# EAGLE design studna (EAGLE 7.7.0)
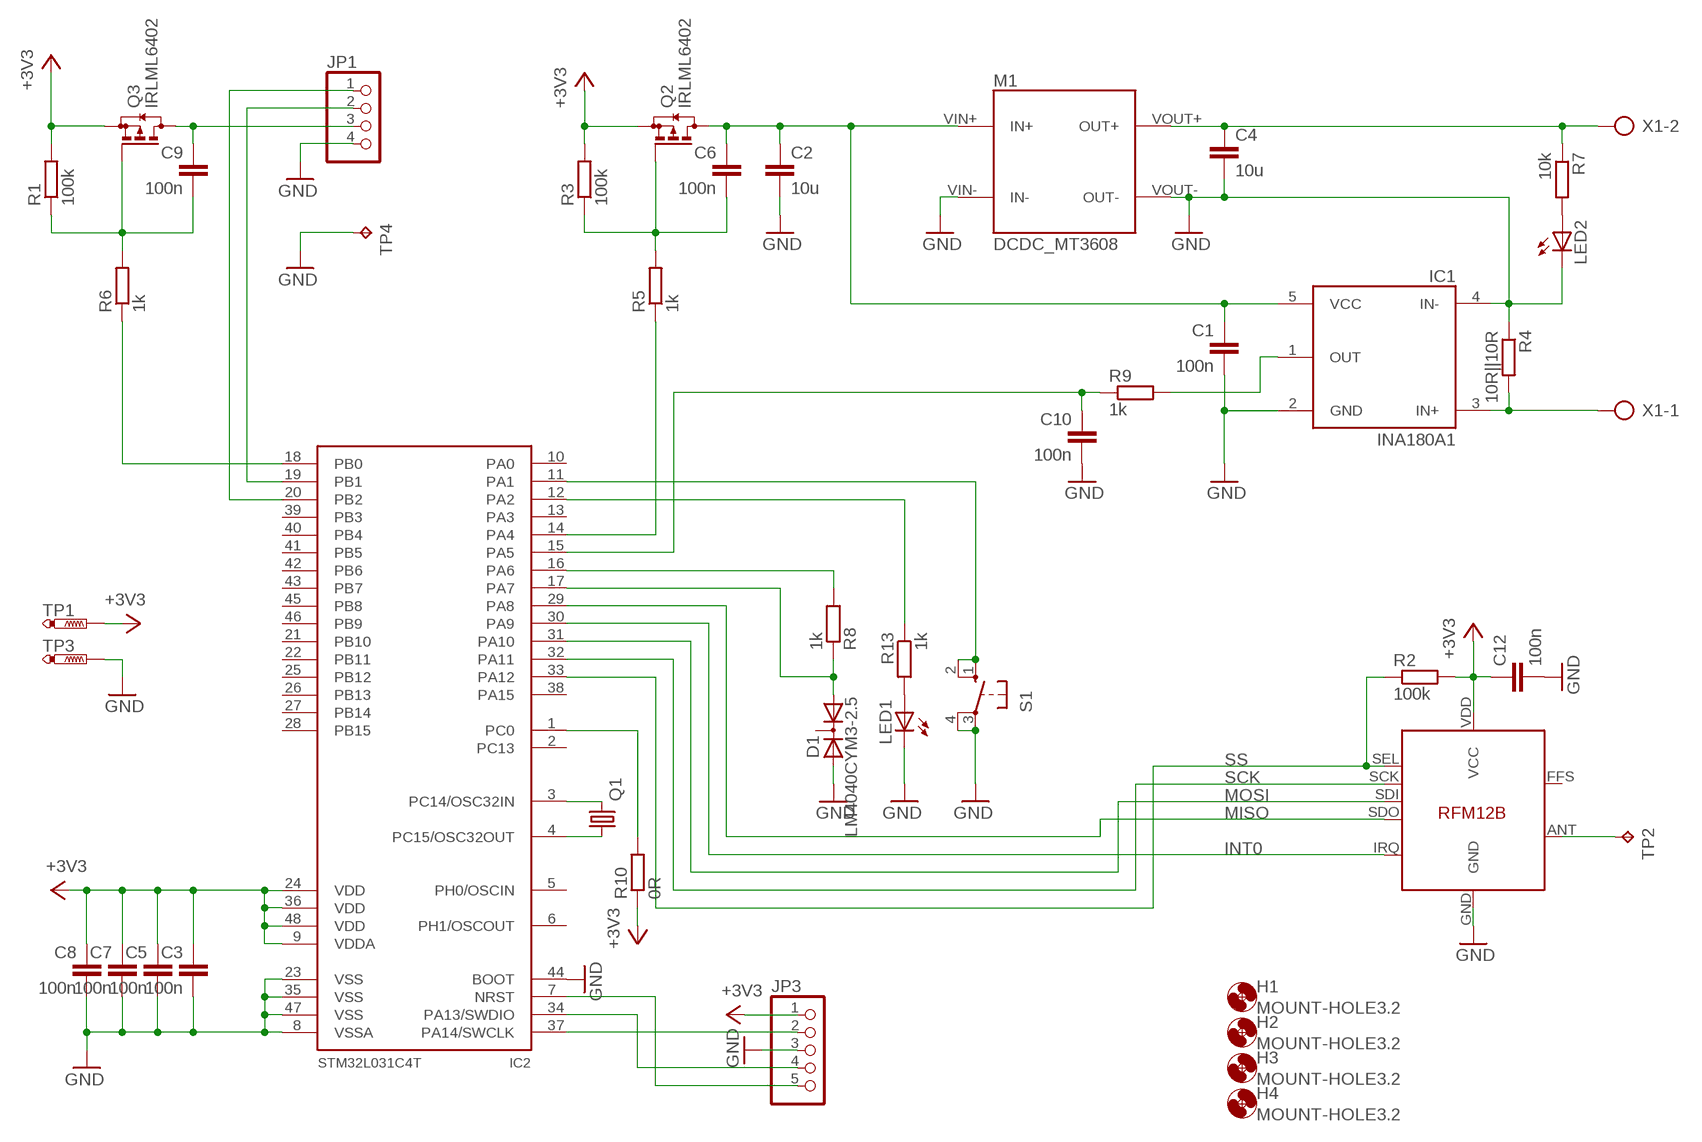
[diagram p0: schematic, sheet 1]

## Parts
C1  100n  C-EUC0603  [C0603]
C2  10u  C-EUC1206K  [C1206K]
C3  100n  C-EUC0603  [C0603]
C4  10u  C-EUC1206K  [C1206K]
C5  100n  C-EUC0603  [C0603]
C6  100n  C-EUC0603  [C0603]
C7  100n  C-EUC0603  [C0603]
C8  100n  C-EUC0603  [C0603]
C9  100n  C-EUC0603  [C0603]
C10  100n  C-EUC0603  [C0603]
C12  100n  C-EUC0603  [C0603]
D1  LM4040CYM3-2.5  DIODE-2AC|CASOT23  [SOT23]
H1  MOUNT-HOLE3.2  [3,2]
H2  MOUNT-HOLE3.2  [3,2]
H3  MOUNT-HOLE3.2  [3,2]
H4  MOUNT-HOLE3.2  [3,2]
IC1  INA180A1  INA180  [SOT23-5L]
IC2  STM32L031C4T  [LQFP48]
IC3  RFM12B  [RFM12B]
JP1  PINHD-1X4  [1X04]
JP3  PINHD-1X5  [1X05]
LED1  LED3MM  [LED3MM]
LED2  LED3MM  [LED3MM]
M1  DCDC_MT3608  [DCDC_MT3608]
Q1  CRYSTALTC38H  [TC38H]
Q2  IRLML6402  BSS84  [SOT23]
Q3  IRLML6402  BSS84  [SOT23]
R1  100k  R-EU_R0603  [R0603]
R2  100k  R-EU_R0603  [R0603]
R3  100k  R-EU_R0603  [R0603]
R4  10R||10R  R-EU_R1206  [R1206]
R5  1k  R-EU_R0603  [R0603]
R6  1k  R-EU_R0603  [R0603]
R7  10k  R-EU_R0603  [R0603]
R8  1k  R-EU_R0603  [R0603]
R9  1k  R-EU_R0603  [R0603]
R10  0R  R-EU_R0603  [R0603]
R13  1k  R-EU_R0603  [R0603]
S1  10-XX  [B3F-10XX]
TP1  PTR1PAD1-17Y  [P1-17Y]
TP2  TPB2,54  [B2,54]
TP3  PTR1PAD1-17Y  [P1-17Y]
TP4  TPPAD1-13Y  [P1-13Y]
X1  AK500/2  [AK500/2]

## Nets
+3V3 [power]: C3.1 C5.1 C7.1 C8.1 C12.1 IC2.9(VDDA) IC2.24(VDD) IC2.36(VDD) IC2.48(VDD) IC3.VDD(VCC) JP3.1 Q2.2(S) Q3.2(S) R1.2 R2.2 R3.2 R10.1 TP1.TP
DCDC_3V3: C1.1 C2.1 C6.1 IC1.5(VCC) M1.VIN+(IN+) Q2.3(D)
DISP_3V3: C9.1 JP1.3 Q3.3(D)
GND: C1.2 C2.2 C3.2 C4.2 C5.2 C7.2 C8.2 C10.2 C12.2 D1.2(A2) IC1.2(GND) IC1.4(IN-) IC2.8(VSSA) IC2.23(VSS) IC2.35(VSS) IC2.44(BOOT) IC2.47(VSS) IC3.GND JP1.4 JP3.3 LED1.K(C) LED2.K(C) M1.VIN-(IN-) M1.VOUT-(OUT-) R4.1 S1.3(P) S1.4(P1) TP3.TP TP4.TP
INT0: IC2.30(PA9) IC3.IRQ
MISO: IC2.29(PA8) IC3.SDO
MOSI: IC2.31(PA10) IC3.SDI
N$1: C6.2 Q2.1(G) R3.1 R5.2
N$2: D1.1(A1) IC2.17(PA7) R8.1
N$3: IC1.3(IN+) R4.2 X1.1
N$4: IC2.4(PC15/OSC32OUT) Q1.1
N$5: IC2.3(PC14/OSC32IN) Q1.2
N$6: IC3.ANT TP2.TP
N$7: C4.1 M1.VOUT+(OUT+) R7.1 X1.2
N$8: C10.1 IC2.15(PA5) R9.1
N$9: LED2.A R7.2
N$10: IC2.19(PB1) JP1.2
N$11: IC2.14(PA4) R5.1
N$12: IC1.1(OUT) R9.2
N$13: IC2.16(PA6) R8.2
N$14: LED1.A R13.2
N$15: IC2.11(PA1) S1.1(S) S1.2(S1)
N$16: IC2.1(PC0) R10.2
N$17: C9.2 Q3.1(G) R1.1 R6.2
N$18: IC2.18(PB0) R6.1
N$19: IC2.20(PB2) JP1.1
N$29: IC2.12(PA2) R13.1
N$137: IC2.34(PA13/SWDIO) JP3.4
N$138: IC2.37(PA14/SWCLK) JP3.2
N$143: IC2.7(NRST) JP3.5
SCK: IC2.32(PA11) IC3.SCK
SS: IC2.33(PA12) IC3.SEL R2.1
Unconnected: D1.3(C) IC2.2(PC13) IC2.5(PH0/OSCIN) IC2.6(PH1/OSCOUT) IC2.10(PA0) IC2.13(PA3) IC2.21(PB10) IC2.22(PB11) IC2.25(PB12) IC2.26(PB13) IC2.27(PB14) IC2.28(PB15) IC2.38(PA15) IC2.39(PB3) IC2.40(PB4) IC2.41(PB5) IC2.42(PB6) IC2.43(PB7) IC2.45(PB8) IC2.46(PB9) IC3.FFS

## Library data of the parts
C1-C10 C12 = rcl:C-EU: CAPACITOR, European symbol
D1 = diode:DIODE-2AC|CA: Dual DIODE Anode-Cathode|Cathode-Anode
H1-H4 = holes:MOUNT-HOLE: MOUNTING HOLE with drill center marker
IC1 = alpov:INA180
IC2 = alpov2:STM32L031C4T
IC3 = JeeLabs:RFM12B
JP1 = pinhead:PINHD-1X4: PIN HEADER
JP3 = pinhead:PINHD-1X5: PIN HEADER
LED1 LED2 = led:LED: LED OSRAM: - CHIPLED LG R971, LG N971, LY N971, LG Q971, LY Q971, LO R971, LY R971 LH N974, LH R974 LS Q976, LO Q976, LY Q976 LO Q996 - Hyper CHIPLED LW Q18S LB Q993, LB Q99A, LB R99A - SideLED LS A670, LO A670, LY A670, LG A670, LP A670 LB A673, LV A673, LT A673, LW A673 LH A674 LY A675 LS A676, LA A676, LO A676, LY A676, LW A676 LS A679, LY A679, LG A679 - Hyper Micro SIDELED® LS Y876, LA Y876, LO Y876, LY Y876 LT Y87S - SmartLED LW L88C, LW L88S LB L89C, LB L89S, LG L890 LS L89K, LO L89K, LY L89K LS L896, LA L896, LO L896, LY L896 - TOPLED LS T670, LO T670, LY T670, LG T670, LP T670 LSG T670, LSP T670, LSY T670, LOP T670, LYG T670 LG T671, LOG T671, LSG T671 LB T673, LV T673, LT T673, LW T673 LH T674 LS T676, LA T676, LO T676, LY T676, LB T676, LH T676, LSB T676, LW T676 LB T67C, LV T67C, LT T67C, LS T67K, LO T67K, LY T67K, LW E67C LS E67B, LA E67B, LO E67B, LY E67B, LB E67C, LV E67C, LT E67C LW T67C LS T679, LY T679, LG T679 LS T770, LO T770, LY T770, LG T770, LP T770 LB T773, LV T773, LT T773, LW T773 LH T774 LS E675, LA E675, LY E675, LS T675 LS T776, LA T776, LO T776, LY T776, LB T776 LHGB T686 LT T68C, LB T68C - Hyper Mini TOPLED® LB M676 - Mini TOPLED Santana® LG M470 LS M47K, LO M47K, LY M47K Source: http://www.osram.convergy.de LUXEON: - LUMILED® LXK2-PW12-R00, LXK2-PW12-S00, LXK2-PW14-U00, LXK2-PW14-V00 LXK2-PM12-R00, LXK2-PM12-S00, LXK2-PM14-U00 LXK2-PE12-Q00, LXK2-PE12-R00, LXK2-PE12-S00, LXK2-PE14-T00, LXK2-PE14-U00 LXK2-PB12-K00, LXK2-PB12-L00, LXK2-PB12-M00, LXK2-PB14-N00, LXK2-PB14-P00, LXK2-PB14-Q00 LXK2-PR12-L00, LXK2-PR12-M00, LXK2-PR14-Q00, LXK2-PR14-R00 LXK2-PD12-Q00, LXK2-PD12-R00, LXK2-PD12-S00 LXK2-PH12-R00, LXK2-PH12-S00 LXK2-PL12-P00, LXK2-PL12-Q00, LXK2-PL12-R00 Source: www.luxeon.com KINGBRIGHT: KA-3528ASYC Source: www.kingbright.com
M1 = alpov:DCDC
Q1 = crystal:CRYSTAL: CRYSTAL; OC_FARNELL: unknown; OC_NEWARK: unknown
Q2 Q3 = transistor-small-signal:BSS84: P-CHANNEL MOS FET
R1-R10 R13 = rcl:R-EU_: RESISTOR, European symbol
S1 = switch-omron:10-XX: OMRON SWITCH; MPN: B3F-1000; OC_FARNELL: 176432; OC_NEWARK: 36M3542
TP1 TP3 = testpad:PTR1: TEST PIN
TP2 TP4 = testpad:TP: Test pad
X1 = con-ptr500:AK500/2: CONNECTOR; OC_FARNELL: unknown; OC_NEWARK: unknown

## Net classes
1 power: width 0.2 mm

## Board
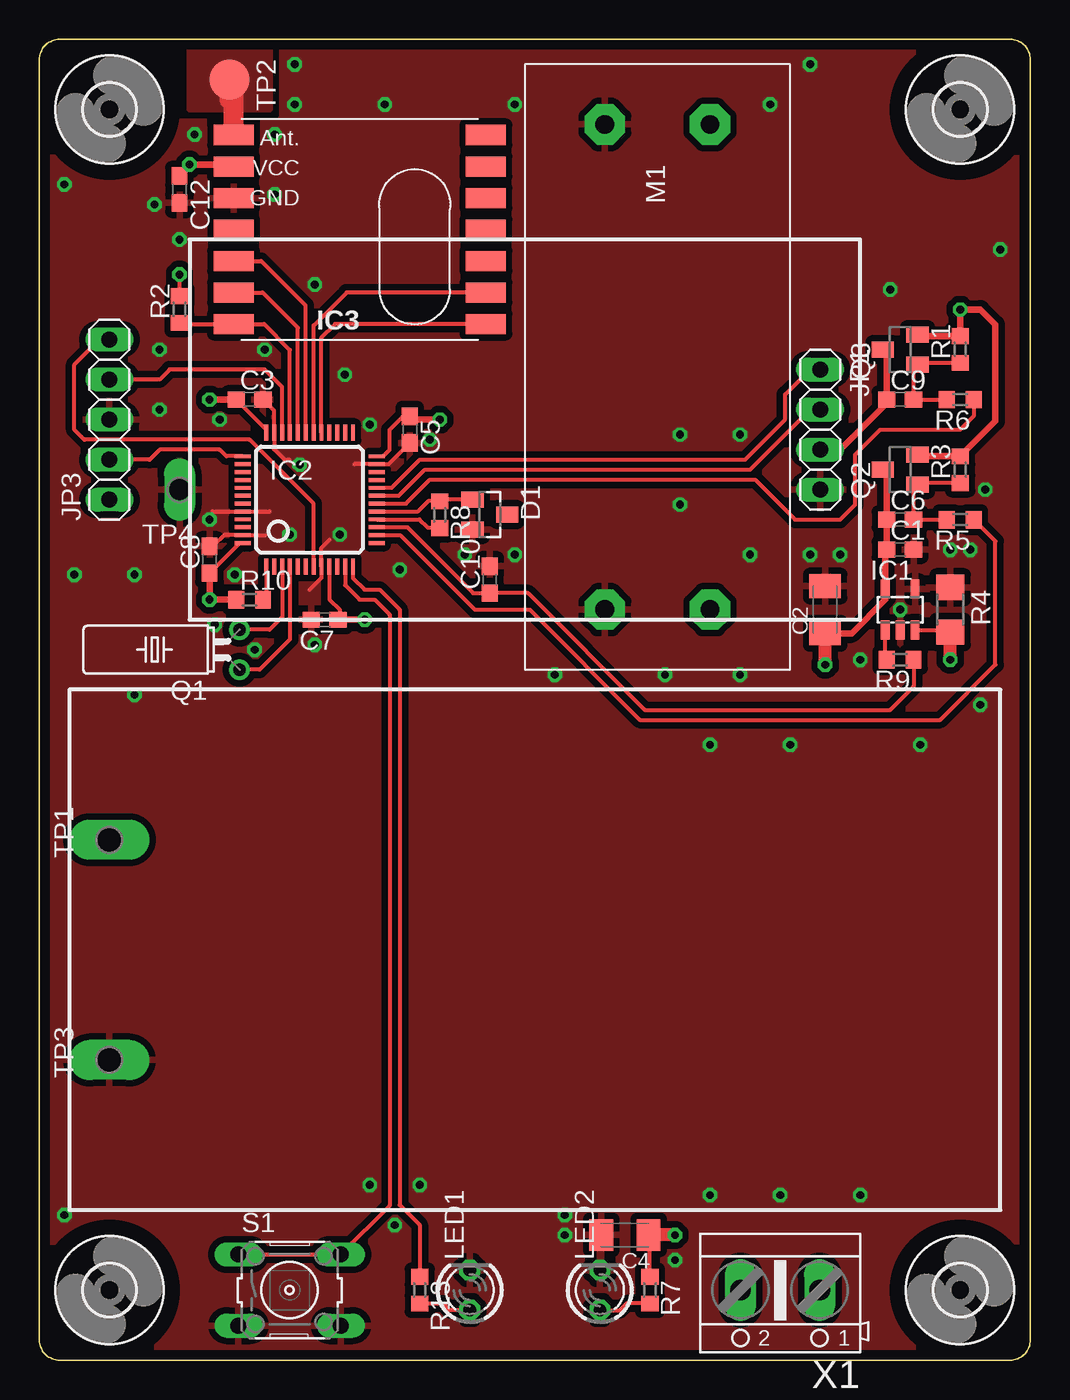
[diagram p1: board, top side]
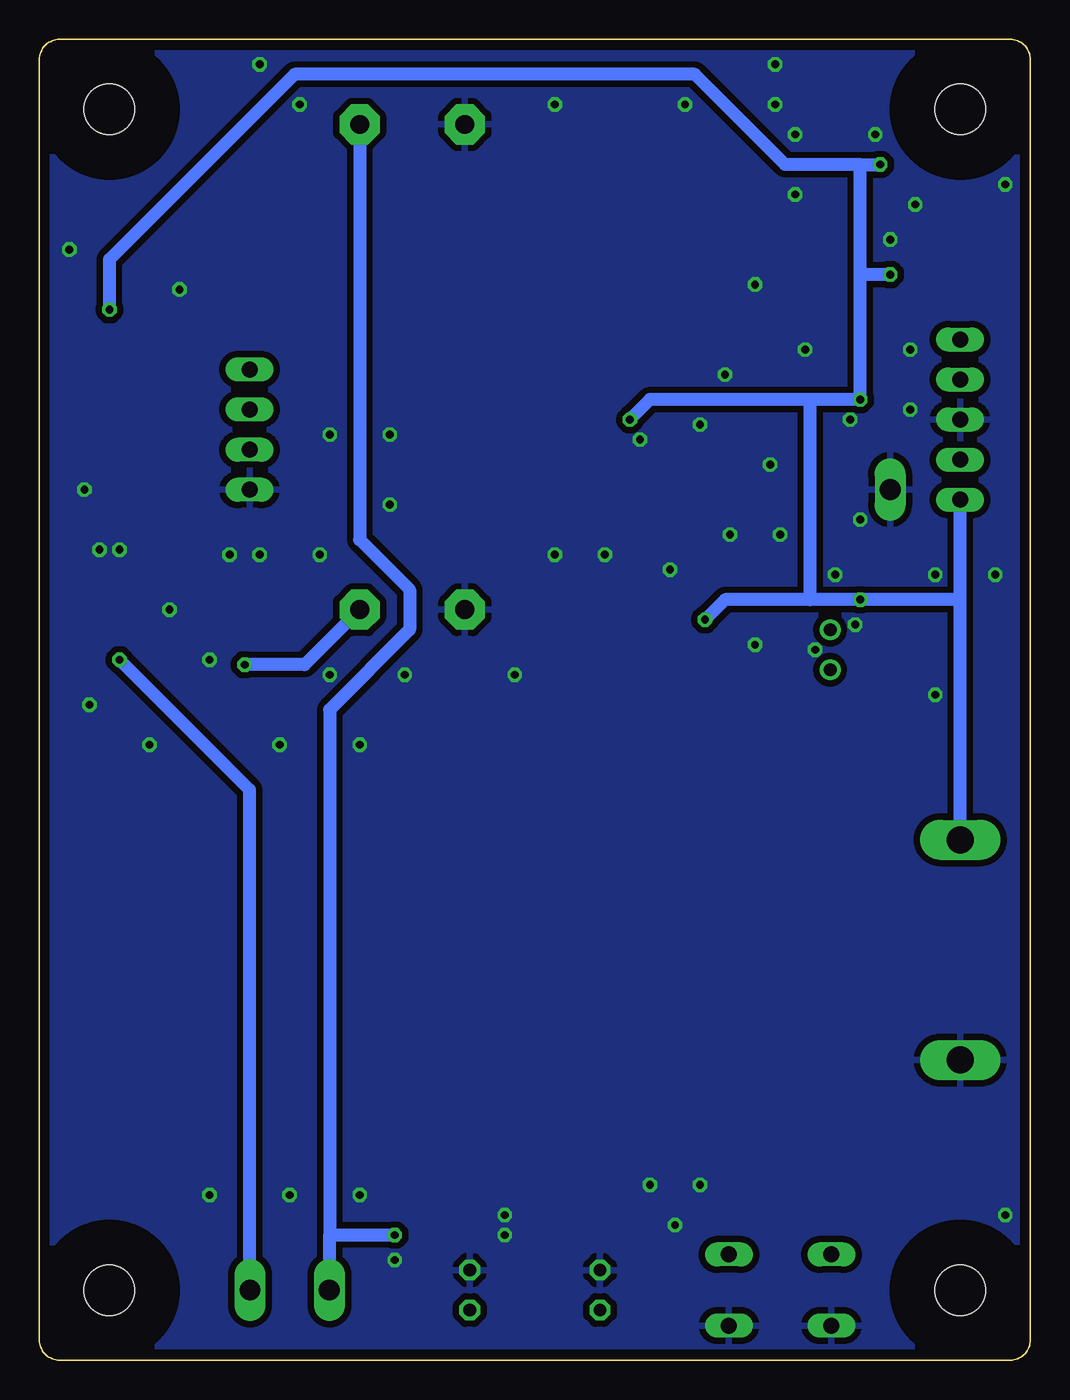
[diagram p2: board, bottom side, seen from below]

Size 62.87 x 83.82 mm. Coordinates in mm from the lower left corner, seen from the top.
Outline: 1.27,0 61.59,0 arc90 62.87,1.27 62.87,82.55 arc90 61.59,83.82 1.27,83.82 arc90 0,82.55 0,1.27 arc90 1.27,0
Copper layers (1*16): Top 0.035mm / dielectric 1.5mm / Bottom 0.035mm
Design rules "default *": minimum track width 0.25mm, minimum drill 0.5mm, track to track 8mil, track to pad 8mil, pad to pad 8mil, via to via 8mil, smd to smd 0mil, copper to edge 24mil, drill to drill 8mil, minimum pad ring 10mil, minimum via ring 8mil, stop-mask expansion 4mil, vias tented up to drill 0.5mm, thermal gap 16mil

### Footprints (pad centres in the part's own frame; a part is rotated, then mirrored left to right if it is on the bottom)
C0603 = smd 1.1 x 1: 1 -0.85,0; 2 0.85,0
C1206K = smd 1.5 x 2: 1 -1.5,0; 2 1.5,0
SOT23 = smd 1 x 1.4: 1 -0.95,-1.1; 2 0.95,-1.1; 3 0,1.1
3,2 = hole 3.2: 0,0
SOT23-5L = smd 0.55 x 1.2: 1 -0.95,-1.3; 2 0,-1.3; 3 0.95,-1.3; 4 0.95,1.3; 5 -0.95,1.3
LQFP48 = smd 0.25 x 1: 1 -2.75,-4.25; 2 -2.25,-4.25; 3 -1.75,-4.25; 4 -1.25,-4.25; 5 -0.75,-4.25; 6 -0.25,-4.25; 7 0.25,-4.25; 8 0.75,-4.25; 9 1.25,-4.25; 10 1.75,-4.25; 11 2.25,-4.25; 12 2.75,-4.25; 25 2.75,4.25; 26 2.25,4.25; 27 1.75,4.25; 28 1.25,4.25; 29 0.75,4.25; 30 0.25,4.25; 31 -0.25,4.25; 32 -0.75,4.25; 33 -1.25,4.25; 34 -1.75,4.25; 35 -2.25,4.25; 36 -2.75,4.25 | smd 1 x 0.25: 13 4.25,-2.75; 14 4.25,-2.25; 15 4.25,-1.75; 16 4.25,-1.25; 17 4.25,-0.75; 18 4.25,-0.25; 19 4.25,0.25; 20 4.25,0.75; 21 4.25,1.25; 22 4.25,1.75; 23 4.25,2.25; 24 4.25,2.75; 37 -4.25,2.75; 38 -4.25,2.25; 39 -4.25,1.75; 40 -4.25,1.25; 41 -4.25,0.75; 42 -4.25,0.25; 43 -4.25,-0.25; 44 -4.25,-0.75; 45 -4.25,-1.25; 46 -4.25,-1.75; 47 -4.25,-2.25; 48 -4.25,-2.75
RFM12B = smd 2.54 x 1.27: ANT 8,-6; FFS -8,2; GND 8,-2; IRQ -8,4; P$8 -8,0; P$9 -8,-2; P$10 -8,-4; P$12 -8,-6; P$16 8,0; SCK 8,4; SDI 8,2; SDO -8,6; SEL 8,6; VDD 8,-4
1X04 = drill 1.016 long: 1 -3.81,0; 2 -1.27,0; 3 1.27,0; 4 3.81,0
1X05 = drill 1.016 long: 1 -5.08,0; 2 -2.54,0; 3 0,0; 4 2.54,0; 5 5.08,0
LED3MM = drill 0.813 octagon: A -1.27,0; K 1.27,0
DCDC_MT3608 = drill 1.2 pad 2.54 octagon: VIN+ 30.797,6.668; VIN- 30.797,0; VOUT+ 0,6.668; VOUT- 0,0
TC38H = drill 0.813: 1 -1.27,0; 2 1.27,0
R0603 = smd 1 x 1.1: 1 -0.85,0; 2 0.85,0
R1206 = smd 1.6 x 1.803: 1 -1.422,0; 2 1.422,0
B3F-10XX = drill 1.016 long: 1 -3.251,2.261; 2 3.251,2.261; 3 -3.251,-2.261; 4 3.251,-2.261
P1-17Y = drill 1.702 pad 2.121 long: TP 0,0
B2,54 = smd 2.54 x 2.54: TP 0,0
P1-13Y = drill 1.321 pad 1.905 long: TP 0,0
AK500/2 = drill 1.321 long: 1 -2.515,0; 2 2.515,0

### Placement (x,y rotation side)
C1  54.61,51.44 0 top
C2  49.85,47.62 90 top
C3  13.34,60.96 0 top
C4  37.15,7.94 180 top
C5  23.5,59.05 270 top
C6  54.61,53.34 0 top
C7  18.1,46.99 180 top
C8  10.79,50.8 90 top
C9  54.61,60.96 0 top
C10  28.57,49.53 90 top
C12  8.89,74.3 270 top
D1  28.57,53.66 270 top
H1  4.45,4.45 0 top
H2  58.42,4.45 0 top
H3  4.45,79.38 0 top
H4  58.42,79.38 0 top
IC1  54.61,47.62 0 top
IC2  17.14,54.61 0 top
IC3  20.32,71.75 180 top
JP1  49.53,59.05 270 top
JP3  4.45,59.69 90 top
LED1  27.3,4.45 90 top
LED2  35.56,4.45 90 top
M1  35.88,78.42 270 top
Q1  12.7,45.09 90 top
Q2  54.61,56.52 90 top
Q3  54.61,64.14 90 top
R1  58.42,64.14 90 top
R2  8.89,66.67 90 top
R3  58.42,56.52 90 top
R4  57.78,47.62 270 top
R5  58.42,53.34 180 top
R6  58.42,60.96 180 top
R7  38.73,4.45 270 top
R8  25.4,53.66 270 top
R9  54.61,44.45 180 top
R10  13.34,48.26 0 top
R13  24.13,4.45 270 top
S1  15.88,4.45 0 top
TP1  4.45,33.02 90 top
TP2  12.06,81.28 270 top
TP3  4.45,19.05 90 top
TP4  8.89,55.24 180 top
X1  46.99,4.45 180 top

### Tracks (layer width: path | path; a pad name or v marks a point on that pad's centre or on a via)
+3V3  (via drill 0.5)
  Top 0.254: IC2.36 14.39,59.05 C3.1 | IC2.48 12.71,51.86 C8.1 | 12.19,75.88 IC3.VDD | v9.53,75.88 9.63,75.88 | IC2.9 18.39,48.28 19.05,47.62 19.05,47.09 C7.1 | 55.81,57.37 Q2.2 | 55.81,64.98 Q3.2 | IC2.24 21.8,57.36 22.23,57.78 22.23,59.05 23.07,59.91 C5.1 | R2.2 v8.89,68.9
  Top 0.406: C8.1 v10.79,48.26 R10.1 | C7.1 v20.64,46.99 | v25.4,59.69 23.71,59.69 C5.1 | v10.79,60.96 C3.1 | v9.53,75.88 12.19,75.88 | 9.63,75.88 C12.1 | 55.81,57.37 R3.2 60.64,59.59 60.64,65.72 59.69,66.67 v58.42,66.67 R1.2 55.81,64.98
  Bottom 0.813: 13.97,48.26 v10.79,48.26 4.45,48.26 | 13.97,48.26 19.37,48.26 v20.64,46.99 | 13.97,48.26 13.97,60.96 | 13.97,60.96 v10.79,60.96 10.79,68.9 | 13.97,60.96 24.13,60.96 v25.4,59.69 | 10.79,75.88 v9.53,75.88 | 10.79,68.9 10.79,75.88 | TP1.TP 4.45,48.26 | 4.45,48.26 JP3.1 | 10.79,75.88 15.56,75.88 21.27,81.6 46.67,81.6 58.42,69.85 v58.42,66.67 | v8.89,68.9 10.79,68.9
DCDC_3V3  (via drill 0.5)
  Top 0.254: 53.66,51.34 C1.1 | 53.76,56.27 Q2.3 | IC1.5
  Top 0.406: IC1.5 53.66,51.34 | 53.76,56.27 C6.1 C1.1 | C2.1 51.52,46.12 53.66,48.26 IC1.5
  Top 0.813: v49.85,44.13 C2.1
  Bottom 0.813: M1.VIN+ 46.04,44.13 v49.85,44.13
DISP_3V3
  Top 0.406: Q3.3 53.76,63.88 C9.1 53.76,60.74 50.8,57.78 JP1.3
GND  (via drill 0.5)
  Top 0.254: C3.2 14.89,60.25 IC2.35 14.89,57.81 15.56,57.15 15.88,57.15 | C5.2 22.15,56.86 IC2.23 19.98,56.86 | 16.94,47.3 C7.2 | 14.31,52.36 IC2.47 11.72,52.36 11.01,51.65 C8.2 | 18.41,52.07 17.89,51.55 IC2.8 17.89,49.65 17.14,48.9 | IC2.44 14.61,53.86 | 10.99,53.86 12.7,53.86
  other vias: 7.62,60.33 8.89,71.12 22.86,50.16 53.98,67.94 57.78,51.44 48.9,51.12 26.99,51.12 14.92,77.79 30.16,79.69 19.37,62.55 6.03,49.85 33.34,7.94 39.69,43.5 52.07,44.45 60.96,70.48 16.19,79.69 16.19,82.23 9.84,77.79 14.92,73.98 21.91,79.69 17.46,68.26 1.59,74.61 14.29,64.14 7.62,64.14 20.95,59.37 16.51,56.83 19.05,52.39 15.88,52.39 12.38,49.85 6.03,42.23 17.46,45.4 32.7,43.5 44.45,43.5 45.09,51.12 40.64,54.29 44.45,58.74 40.64,58.74 24.77,58.42 46.35,79.69 48.9,82.23 60.01,55.24 54.61,47.62 50.8,51.12 59.05,51.44 59.69,41.59 47.62,39.05 55.88,39.05 42.55,39.05 20.95,11.11 24.13,11.11 42.55,10.48 46.99,10.48 52.07,10.48 33.34,9.21 1.59,9.21 11.43,59.69 10.79,53.34 30.16,51.12 7.3,73.34 2.22,49.85 11.11,46.67 13.65,45.09 22.54,8.57 40.32,6.35
  pour Top (isolate 0.406, rank 6): 0,0 62.87,0 62.87,83.82 0,83.82
  pour Bottom (isolate 0.406, rank 6): 0,0 62.87,0 62.87,83.82 0,83.82
INT0
  Top 0.254: IC2.30 17.39,65.66 19.5,67.75 IC3.IRQ
MISO
  Top 0.254: IC2.29 17.89,64.89 18.77,65.75 IC3.SDO
MOSI
  Top 0.254: IC2.31 16.89,66.92 14.06,69.75 IC3.SDI
N$1
  Top 0.254: R5.2 C6.2 55.46,55.31 Q2.1 55.81,55.66 R3.1
N$2
  Top 0.254: IC2.17 24.02,53.86 24.66,54.51 R8.1 25.5,54.61 D1.1
N$3  (via drill 0.5)
  Top 0.254: IC1.3 57.66,46.33 R4.2
  Top 0.813: v57.78,44.45 R4.2
  Bottom 0.406: X1.1 49.53,4.45
  Bottom 0.813: 49.53,4.45 49.53,36.2 v57.78,44.45
N$4
  Top 0.254: IC2.4 15.89,45.74 13.97,43.81 Q1.1
N$5
  Top 0.254: IC2.3 15.39,47.15 14.61,46.35 Q1.2
N$6
  Top 1.27: IC3.ANT 12.32,80.27 12.06,80.01
  pour Top (isolate 0.406, rank 2, no thermals): 9.53,83.19 9.53,79.38 14.61,79.38 14.61,83.19
N$7  (via drill 0.5)
  Top 0.254: R7.1 38.73,7.85 C4.1
  Top 0.813: v40.32,7.94 C4.1
  Bottom 0.406: X1.2 44.45,4.45
  Bottom 0.813: M1.VOUT+ 42.55,52.07 39.37,48.9 39.37,46.35 44.45,41.27 44.45,7.94 | 44.45,4.45 44.45,7.94 | 44.45,7.94 v40.32,7.94
N$8
  Top 0.254: IC2.15 23.34,52.86 27.52,48.68 C10.1 31.01,48.68 38.42,41.27 53.98,41.27 55.46,42.76 R9.1
N$9
  Top 0.254: LED2.A 36.83,3.17 37.25,3.6 R7.2
N$10
  Top 0.254: IC2.19 22.79,54.86 24.45,56.52 45.09,56.52 48.9,60.33 JP1.2
N$11
  Top 0.254: IC2.14 22.89,52.36 27.62,47.62 31.11,47.62 38.1,40.64 57.15,40.64 60.64,44.13 60.64,51.97 R5.1
N$12
  Top 0.254: R9.2 53.66,44.45 IC1.1
N$13
  Top 0.254: IC2.16 24.11,53.36 24.66,52.81 R8.2
N$14
  Top 0.254: LED1.A 26.04,3.17 25.61,3.6 R13.2
N$15
  Top 0.254: S1.1 S1.2 22.23,9.8 22.23,47.31 21.27,48.26 20.32,48.26 19.39,49.19 IC2.11
N$16
  Top 0.254: IC2.1 14.39,48.47 R10.2
N$17
  Top 0.254: R1.1 55.81,63.28 Q3.1 55.46,62.94 C9.2 R6.2
N$18
  Top 0.254: IC2.18 23.25,54.36 24.77,55.88 45.4,55.88 47.94,53.34 50.8,53.34 51.75,54.29 51.75,57.47 53.34,59.05 58.42,59.05 59.27,59.91 R6.1
N$19
  Top 0.254: IC2.20 22.34,55.36 24.13,57.15 44.77,57.15 47.31,59.69 47.31,61.28 48.9,62.87 JP1.1
N$29
  Top 0.254: IC2.12 19.89,49.64 20.64,48.9 21.59,48.9 22.86,47.62 22.86,9.84 24.13,8.57 R13.1
N$137
  Top 0.254: IC2.34 15.39,61.76 14.29,62.87 8.26,62.87 7.62,62.23 JP3.4
N$138
  Top 0.254: IC2.37 11.86,57.36 11.43,57.78 7.62,57.78 6.99,57.15 JP3.2
N$143
  Top 0.254: IC2.7 17.39,54.36 13.34,58.42 2.86,58.42 2.22,59.05 2.22,63.18 3.81,64.77 JP3.5
SCK
  Top 0.254: IC2.32 16.39,65.52 14.16,67.75 IC3.SCK
SS
  Top 0.254: IC2.33 15.89,64.11 14.26,65.75 IC3.SEL 8.96,65.75 R2.1

### Text on the board
Muster: ANT | OK2ALP / 2024 | DEBUG | + | + | - | GO | SENS | ATTN | MEAS